# EAGLE design usbaspclone-2-2 (EAGLE 5.10)
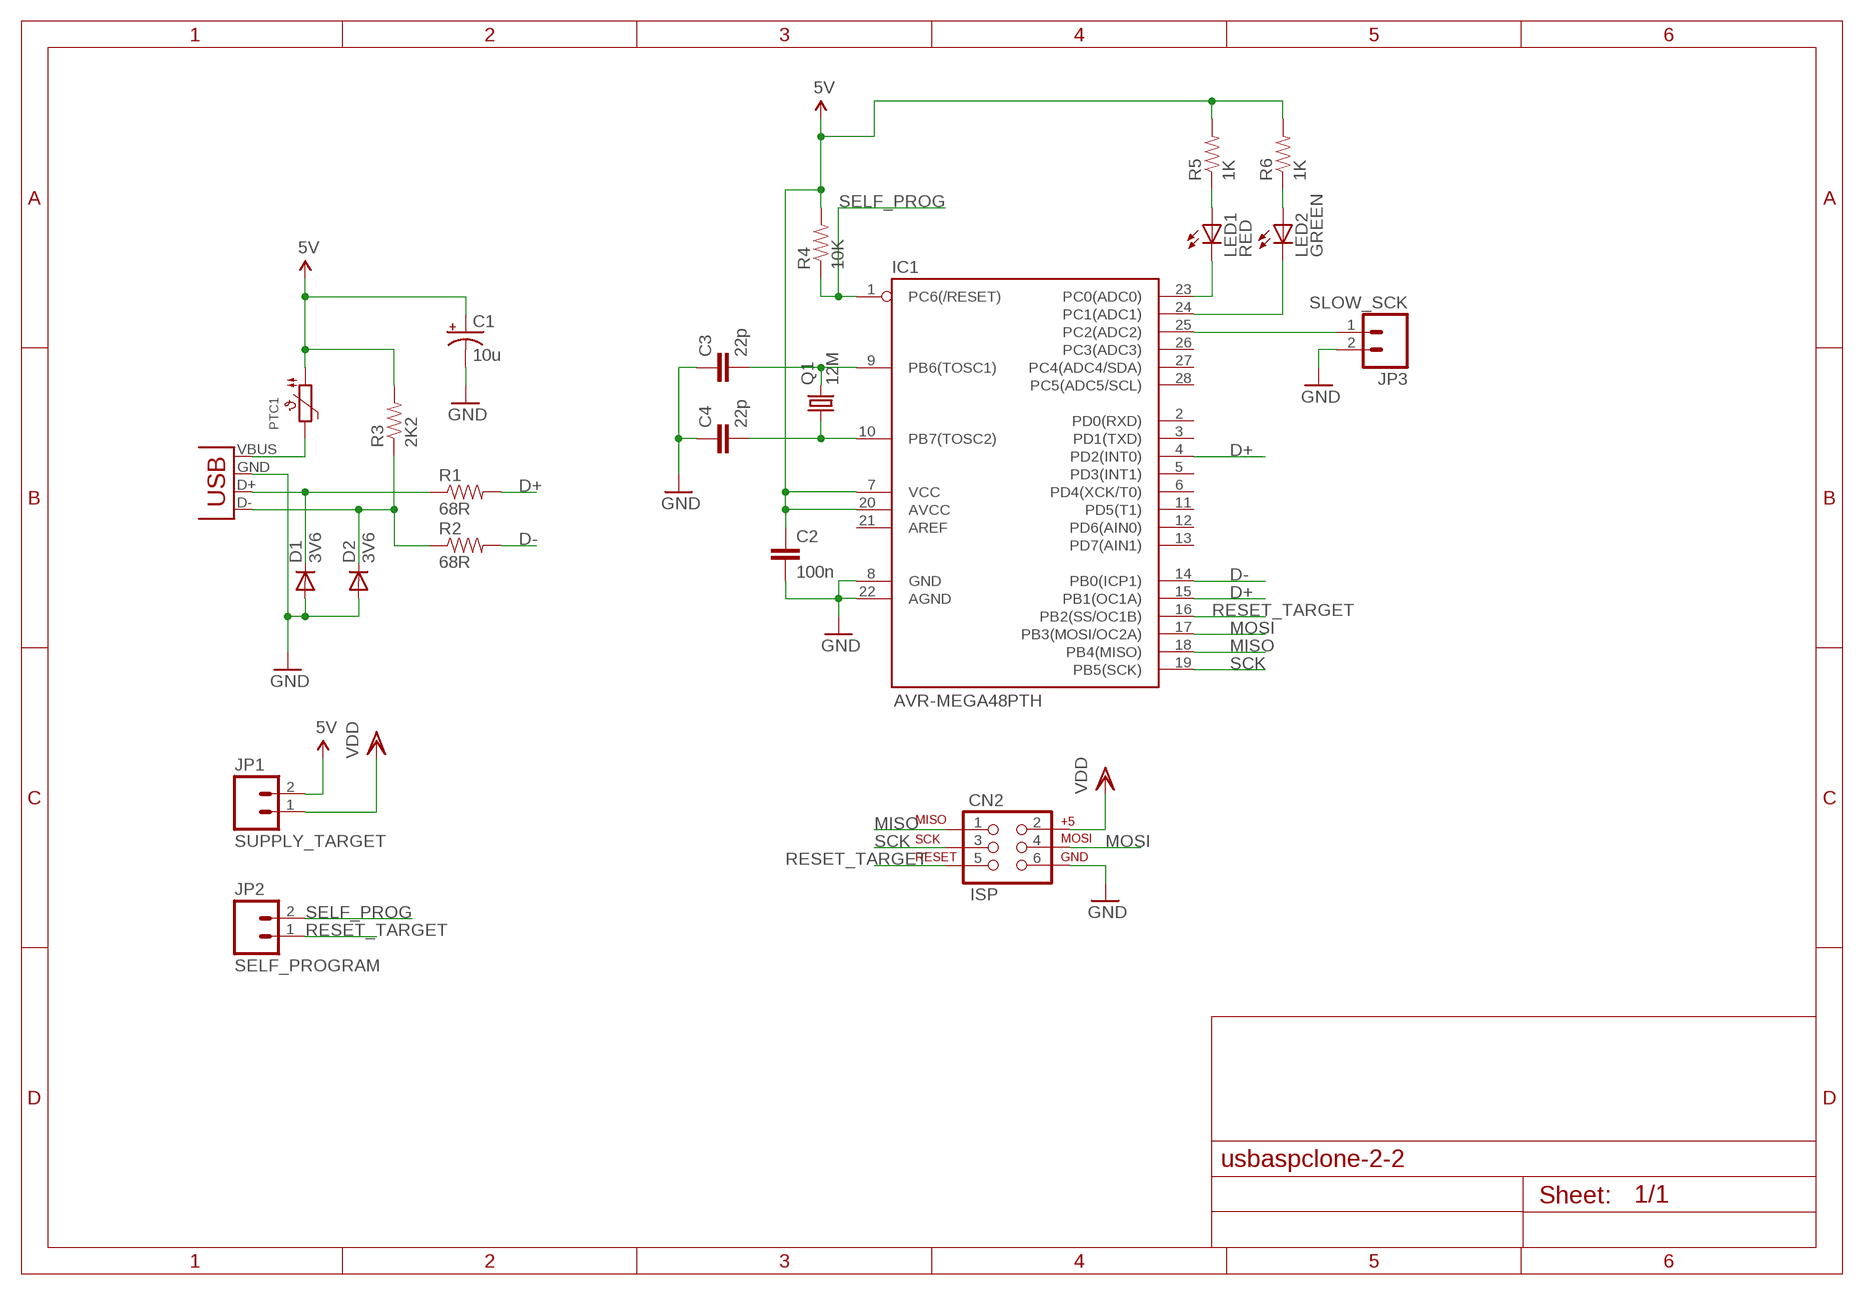
[diagram p0: schematic, sheet 1]

## Parts
C1  10u  CAP_POL1206  [EIA3216]
C2  100n  CAP0805  [0805]
C3  22p  CAP0805  [0805]
C4  22p  CAP0805  [0805]
CN1  USB-A-H  [USB-A-H]
CN2  ISP  AVR_SPI_PRG_6PTH  [2X3]
D1  3V6  DIODE  [SOD80C]
D2  3V6  DIODE  [SOD80C]
IC1  AVR-MEGA48PTH  [DIL28-3]
JP1  SUPPLY_TARGET  M02PTH  [1X02]
JP2  SELF_PROGRAM  M02PTH  [1X02]
JP3  SLOW_SCK  M02PTH  [1X02]
LED1  RED  LED3MM  [LED3MM]
LED2  GREEN  LED3MM  [LED3MM]
PTC1  PTC1812  [PTC1812]
Q1  12M  CRYSTALHC49US  [HC49US]
R1  68R  RESISTOR0805  [0805]
R2  68R  RESISTOR0805  [0805]
R3  2K2  RESISTOR0805  [0805]
R4  10K  RESISTOR0805  [0805]
R5  1K  RESISTOR0805  [0805]
R6  1K  RESISTOR0805  [0805]

## Nets
5V: C1.A(+) C2.1 IC1.7(VCC) IC1.20(AVCC) JP1.2 PTC1.P$1 R3.2 R4.2 R5.2 R6.2
D+: IC1.4(PD2(INT0)) IC1.15(PB1(OC1A)) R1.2
D-: IC1.14(PB0(ICP1)) R2.2
GND: C1.C(-) C2.2 C3.1 C4.1 CN1.GND(VBUS) CN2.6 D1.A D2.A IC1.8(GND) IC1.22(AGND) JP3.2
MISO: CN2.1 IC1.18(PB4(MISO))
MOSI: CN2.4 IC1.17(PB3(MOSI/OC2A))
N$1: CN1.VBUS(GND) PTC1.P$2
N$2: CN1.D+(D-) D1.C R1.1
N$3: CN1.D-(D+) D2.C R2.1 R3.1
N$4: C3.2 IC1.9(PB6(TOSC1)) Q1.2
N$5: C4.2 IC1.10(PB7(TOSC2)) Q1.1
N$6: IC1.23(PC0(ADC0)) LED1.K(C)
N$7: LED1.A R5.1
N$8: IC1.24(PC1(ADC1)) LED2.K(C)
N$9: LED2.A R6.1
N$11: IC1.25(PC2(ADC2)) JP3.1
RESET_TARGET: CN2.5 IC1.16(PB2(SS/OC1B)) JP2.1
SCK: CN2.3 IC1.19(PB5(SCK))
SELF_PROG: IC1.1(PC6(/RESET)) JP2.2 R4.1
VDD: CN2.2 JP1.1
Unconnected: IC1.2(PD0(RXD)) IC1.3(PD1(TXD)) IC1.5(PD3(INT1)) IC1.6(PD4(XCK/T0)) IC1.11(PD5(T1)) IC1.12(PD6(AIN0)) IC1.13(PD7(AIN1)) IC1.21(AREF) IC1.26(PC3(ADC3)) IC1.27(PC4(ADC4/SDA)) IC1.28(PC5(ADC5/SCL))

## Library data of the parts
C1 = usbaspclone:CAP_POL: Capacitor Polarized These are standard SMD and PTH capacitors. Normally 10uF, 47uF, and 100uF in electrolytic and tantalum varieties. Always verify the external diameter of the through hole cap, it varies with capacity, voltage, and manufacturer. The EIA devices should be standard.
C2-C4 = usbaspclone:CAP: Capacitor Standard 0603 ceramic capacitor, and 0.1" leaded capacitor.
CN1 = usbaspclone:USB: USB Connectors USB-B-PTH is fully proven SKU : PRT-00139 USB-miniB is fully proven SKU : PRT-00587 USB-A-PCB is untested. USB-A-H is throughly reviewed, but untested. Spark Fun Electronics SKU : PRT-00437 USB-B-SMT is throughly reviewed, but untested. Needs silkscreen touching up. USB-A-S has not been used/tested USB-MB-H has not been used/tested
CN2 = usbaspclone:AVR_SPI_PRG_6: AVR ISP 6 Pin This is the reduced ISP connector for AVR programming. Common on Arduino. This footprint will take up less PCB space and can be used with a 10-pin to 6-pin adapter such as SKU: BOB-08508
D1 D2 = usbaspclone:DIODE: Diode These are standard reverse protection diodes and small signal diodes. SMA package can handle up to about 1A. SOD-323 can handle about 200mA. What the SOD-323 package when ordering, there are some mfgs out there that are 5-pin packages.
IC1 = usbaspclone:AVR-MEGA48: MICROCONTROLLER ATmega48/88/168
JP1-JP3 = usbaspclone:M02: Header 2 Standard 2-pin 0.1" header. Use with straight break away headers (SKU : PRT-00116), right angle break away headers (PRT-00553), swiss pins (PRT-00743), machine pins (PRT-00117), and female headers (PRT-00115). Molex polarized connector foot print use with SKU : PRT-08233 with associated crimp pins and housings.
LED1 LED2 = usbaspclone:LED: LEDs Standard schematic elements and footprints for 5mm, 3mm, 1206, and 0603 sized LEDs. 5mm - Spark Fun Electronics SKU : COM-00529 (and others)
PTC1 = usbaspclone:PTC: PTC (Resettable Fuse) 1206 Package 250mA PTC (16V Max, Time-to-Trip: 0.08s) - Digikey: F2110CT-ND 1210 Package 100mA PTC (30V Max, Time-to-Trip: 0.6s) - Digikey: MF-USMF010-2CT-ND 1812 Package 750mA PTC (24V Max, Time-to-Trip: 0.2s) - Digikey: MF-MSMF075/24-2CT-ND
Q1 = usbaspclone:CRYSTAL: Crystals Various standard crystals. Proven footprints. Spark Fun Electronics SKU : COM-00534
R1-R6 = usbaspclone:RESISTOR: Resistor Basic schematic elements and footprints for 0402, 0603, 0805, 1206, PTH 1/10th watt (small), 0102, 0204, and etc. resistors.

## Board
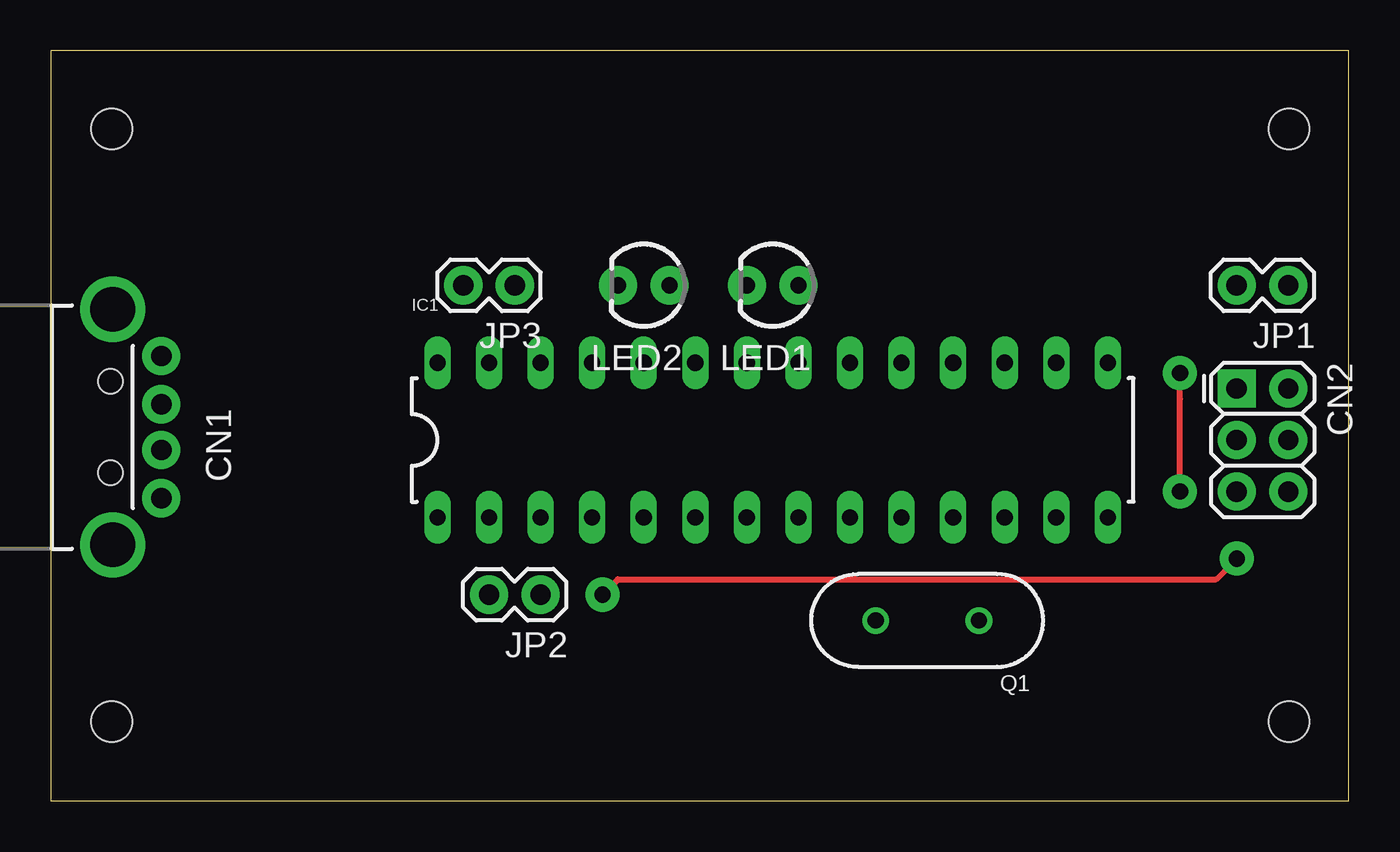
[diagram p1: board, top side]
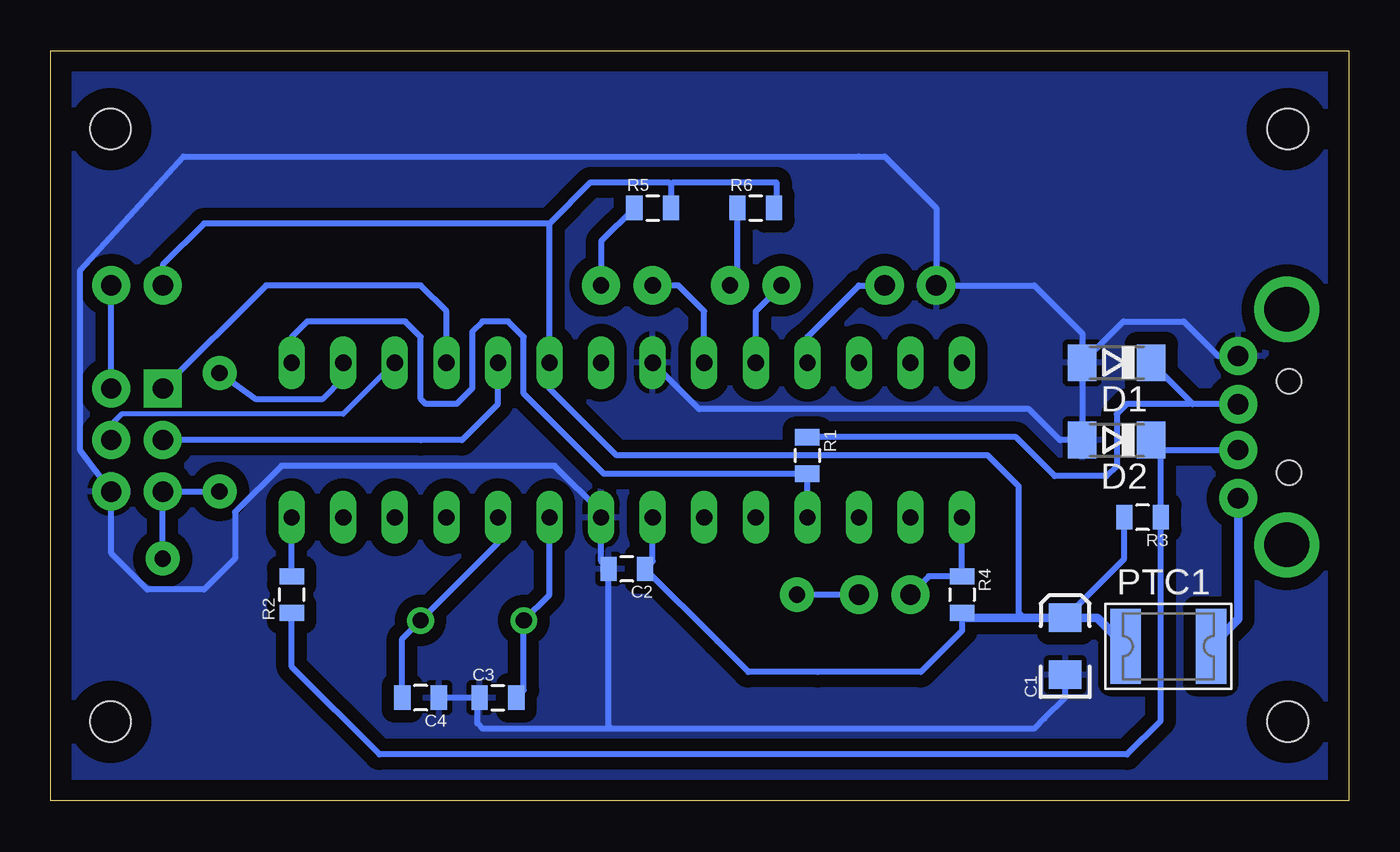
[diagram p2: board, bottom side, seen from below]

Size 63.94 x 36.96 mm. Coordinates in mm from the lower left corner, seen from the top.
Outline: 0,0 63.94,0 63.94,36.96 0,36.96 0,0
Copper layers (1*16): Top 0.035mm / dielectric 1.5mm / Bottom 0.035mm
Design rules "8mils": minimum track width 8mil, minimum drill 0.6mm, track to track 8mil, track to pad 8mil, pad to pad 8mil, via to via 8mil, smd to smd 8mil, copper to edge 40mil, drill to drill 10mil, minimum pad ring 10mil, minimum via ring 8mil, stop-mask expansion 0mil, vias tented up to drill 0mil, thermal gap 10mil
Holes 2 mm at 3,3.9 3,33.1 61,33.1 61,3.9

### Footprints (pad centres in the part's own frame; a part is rotated, then mirrored left to right if it is on the bottom)
EIA3216 = smd 1.4 x 1.6: A 1.4,0; C -1.4,0
0805 = smd 0.8 x 1.2: 1 -0.9,0; 2 0.9,0
USB-A-H = drill 1 pad 1.88 round: D+ 2.4,1.127; D- 2.4,-1.127; GND 2.4,3.5; VBUS 2.4,-3.5 | drill 2.2 round: GND2 0,-5.8; GND3 0,5.8 | hole 1.2: -0.1,2.25; -0.1,-2.25
2X3 = drill 1 pad 1.88 square: 1 0,0 | drill 1 pad 1.88 round: 2 0,2.54; 3 2.54,0; 4 2.54,2.54; 5 5.08,0; 6 5.08,2.54
SOD80C = smd 1.4 x 1.8: A 1.7,0; C -1.7,0
DIL28-3 = drill 0.8 long: 1 -16.51,-3.81; 2 -13.97,-3.81; 3 -11.43,-3.81; 4 -8.89,-3.81; 5 -6.35,-3.81; 6 -3.81,-3.81; 7 -1.27,-3.81; 8 1.27,-3.81; 9 3.81,-3.81; 10 6.35,-3.81; 11 8.89,-3.81; 12 11.43,-3.81; 13 13.97,-3.81; 14 16.51,-3.81; 15 16.51,3.81; 16 13.97,3.81; 17 11.43,3.81; 18 8.89,3.81; 19 6.35,3.81; 20 3.81,3.81; 21 1.27,3.81; 22 -1.27,3.81; 23 -3.81,3.81; 24 -6.35,3.81; 25 -8.89,3.81; 26 -11.43,3.81; 27 -13.97,3.81; 28 -16.51,3.81
1X02 = drill 1 pad 1.88 round: 1 0,0; 2 2.54,0
LED3MM = drill 0.8 pad 1.88 round: A -1.27,0; K 1.27,0
PTC1812 = smd 1.5 x 3.7: P$1 -2.1,0; P$2 2.1,0
HC49US = drill 0.8 round: 1 -2.54,0; 2 2.54,0

### Placement (x,y rotation side)
C1  13.97,7.62 90 bottom
C2  35.56,11.43 180 bottom
C3  41.91,5.08 0 bottom
C4  45.72,5.08 180 bottom
CN1  3.05,18.41 0 top
CN2  58.42,20.32 270 top
D1  11.43,21.59 180 bottom
D2  11.43,17.78 180 bottom
IC1  35.56,17.78 0 top
JP1  60.96,25.4 180 top
JP2  24.13,10.16 180 top
JP3  22.86,25.4 180 top
LED1  35.56,25.4 180 top
LED2  29.21,25.4 180 top
PTC1  8.89,7.62 0 bottom
Q1  43.18,8.89 180 top
R1  26.67,17.02 270 bottom
R2  52.07,10.16 90 bottom
R3  10.16,13.97 180 bottom
R4  19.05,10.16 270 bottom
R5  34.29,29.21 0 bottom
R6  29.21,29.21 0 bottom

### Tracks (layer width: path | path; a pad name or v marks a point on that pad's centre or on a via)
5V
  Bottom 0.305: R3.2 11.06,11.93 C1.A | 33.39,30.36 R5.2 | 33.39,30.36 33.27,30.48 28.19,30.48 28.19,29.33 R6.2 | 39.37,28.45 IC1.20 39.37,20.32 36.07,17.02 25.65,17.02 17.78,17.02 16.26,15.49 16.26,9.27 16,9.02 | 39.37,28.45 37.34,30.48 33.51,30.48 33.39,30.36 | IC1.7 34.29,11.8 C2.1 31.1,7.87 29.58,6.35 26.16,6.35 21.08,6.35 19.56,7.87 19.05,8.38 R4.2 | JP1.2 58.42,26.42 56.39,28.45 39.37,28.45
  Bottom 0.406: PTC1.P$1 12.39,9.02 C1.A 16,9.02 18.81,9.02 R4.2
D+
  Bottom 0.305: IC1.4 R1.2 36.69,16.12 40.64,20.07 40.64,22.86 41.4,23.62 42.67,23.62 43.18,23.11 43.18,20.32 43.94,19.56 45.47,19.56 45.72,19.81 45.72,22.86 46.48,23.62 51.31,23.62 52.07,22.86 IC1.15
D-
  Bottom 0.305: R2.2 IC1.14
GND
  Bottom 0.305: CN1.GND 6.42,21.91 8.13,23.62 11.1,23.62 D1.A | D1.A 13.13,23.04 15.49,25.4 JP3.2 20.32,29.21 22.86,31.75 24.13,31.75 57.4,31.75 62.48,26.16 62.48,17.27 CN2.6 60.96,12.19 59.18,10.41 56.39,10.41 54.86,11.94 54.86,14.22 52.58,16.51 39.12,16.51 36.83,14.22 IC1.8 36.83,11.8 C2.2 36.46,3.69 36.32,3.56 | C4.1 C3.1 42.93,4.96 42.93,3.81 42.67,3.56 36.32,3.56 | C1.C 13.97,5.08 14.99,4.06 15.49,3.56 36.32,3.56 | D1.A D2.A 14.22,17.78 15.75,19.3 32,19.3 IC1.22
  pour Bottom (isolate 0.61): 0,36.83 0,0 63.5,0 63.5,36.83
MISO
  Bottom 0.305: IC1.18 44.45,24.13 45.72,25.4 53.34,25.4 CN2.1
MOSI
  Bottom 0.254: CN2.4 60.96,18.54 60.45,19.05 49.53,19.05 IC1.17
N$1
  Bottom 0.406: CN1.VBUS 5.45,8.96 PTC1.P$2
N$2
  Bottom 0.305: CN1.D+ 7.68,19.54 7.79,19.65 | 7.79,19.65 D1.C | R1.1 16.39,17.92 14.48,16 11.94,16 11.43,16.51 11.43,19.05 10.92,19.56 7.87,19.56 7.79,19.65
N$3
  Bottom 0.305: CN1.D- 9.24,17.29 D2.C 9.26,17.31 R3.1 9.26,3.95 10.92,2.29 47.75,2.29 52.07,6.6 R2.1
N$4
  Bottom 0.305: IC1.9 39.37,10.16 Q1.2 40.64,5.45 C3.2
N$5
  Bottom 0.305: IC1.10 41.91,12.7 Q1.1 46.62,7.99 C4.2
N$6
  Bottom 0.305: IC1.23 31.75,24.13 33.02,25.4 LED1.K
N$7
  Bottom 0.305: LED1.A 36.83,27.57 R5.1
N$8
  Bottom 0.305: IC1.24 29.21,24.13 LED2.K
N$9
  Bottom 0.305: R6.1 30.11,25.77 LED2.A
N$11
  Bottom 0.305: IC1.25 26.67,22.86 24.13,25.4 JP3.1
RESET_TARGET  (via drill 0.8 pad 1.68)
  Top 0.305: v58.42,11.94 57.4,10.92 39.62,10.92 27.94,10.92 v27.18,10.16 | v55.63,15.24 55.63,19.81 v55.63,21.08
  Bottom 0.305: v58.42,11.94 CN2.5 v55.63,15.24 | IC1.16 49.53,20.83 50.55,19.81 53.85,19.81 v55.63,21.08 | JP2.1 v27.18,10.16
SCK
  Bottom 0.305: CN2.3 45.72,17.78 43.69,17.78 41.91,19.56 IC1.19
SELF_PROG
  Bottom 0.305: IC1.1 R4.1 20.69,11.06 JP2.2
VDD
  Bottom 0.305: CN2.2 JP1.1